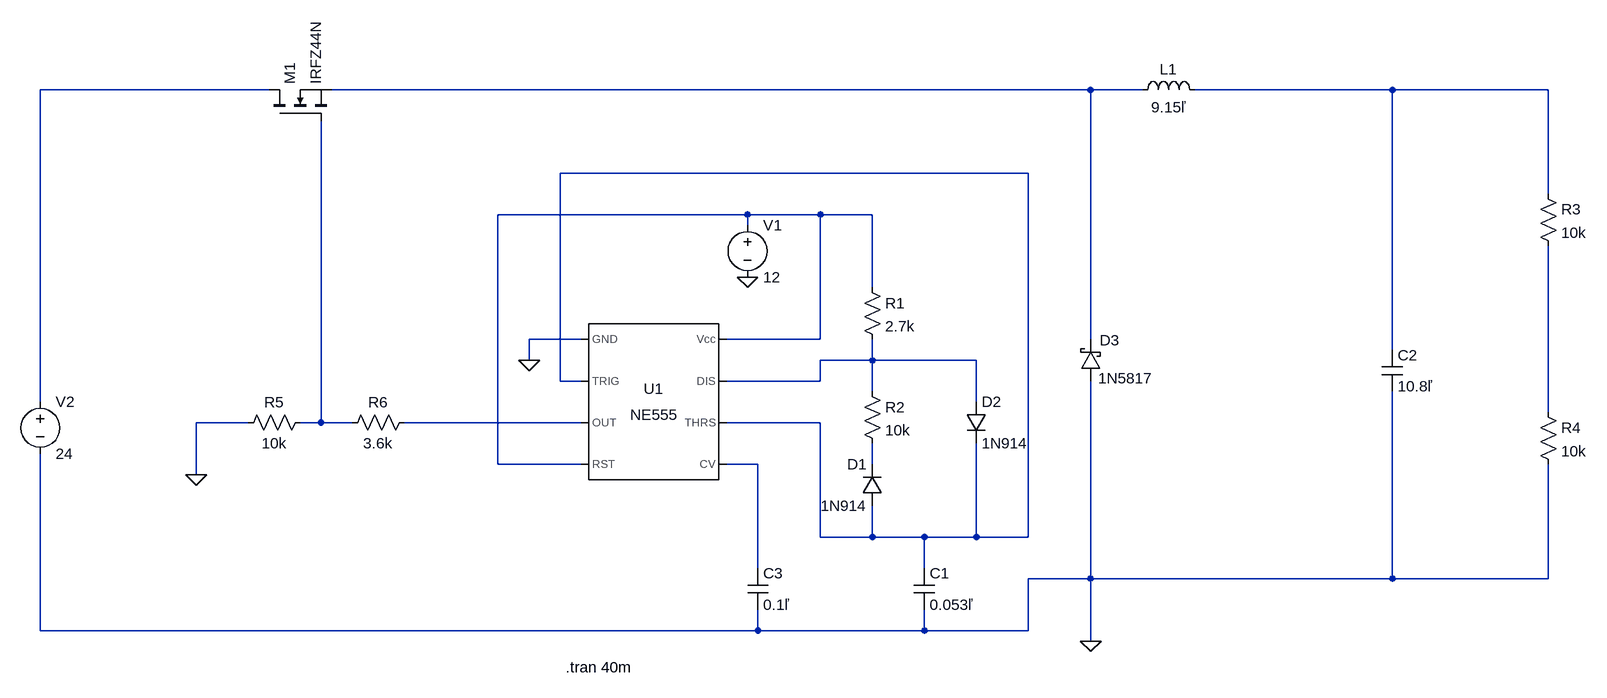
[diagram p0: schematic encore_new_.asc]
encore_new_.asc, the LTspice schematic file:
Version 4
SHEET 1 1524 680
WIRE -976 -336 -1328 -336
WIRE 288 -336 -880 -336
WIRE 368 -336 288 -336
WIRE 752 -336 448 -336
WIRE 992 -336 752 -336
WIRE 192 -208 -528 -208
WIRE 992 -176 992 -336
WIRE -240 -144 -624 -144
WIRE -128 -144 -240 -144
WIRE -48 -144 -128 -144
WIRE -240 -128 -240 -144
WIRE -48 -32 -48 -144
WIRE -496 48 -576 48
WIRE -128 48 -128 -144
WIRE -128 48 -272 48
WIRE 288 48 288 -336
WIRE 752 64 752 -336
WIRE -576 80 -576 48
WIRE -48 80 -48 48
WIRE -48 80 -128 80
WIRE 112 80 -48 80
WIRE -528 112 -528 -208
WIRE -496 112 -528 112
WIRE -128 112 -128 80
WIRE -128 112 -272 112
WIRE -48 128 -48 80
WIRE -1328 144 -1328 -336
WIRE 112 144 112 80
WIRE 992 160 992 -96
WIRE -1008 176 -1088 176
WIRE -896 176 -896 -288
WIRE -896 176 -928 176
WIRE -848 176 -896 176
WIRE -496 176 -768 176
WIRE -128 176 -272 176
WIRE -624 240 -624 -144
WIRE -496 240 -624 240
WIRE -224 240 -272 240
WIRE -48 240 -48 208
WIRE -1088 256 -1088 176
WIRE -128 352 -128 176
WIRE -48 352 -48 304
WIRE -48 352 -128 352
WIRE 32 352 -48 352
WIRE 112 352 112 208
WIRE 112 352 32 352
WIRE 192 352 192 -208
WIRE 192 352 112 352
WIRE -224 400 -224 240
WIRE 32 400 32 352
WIRE 288 416 288 112
WIRE 288 416 192 416
WIRE 752 416 752 128
WIRE 752 416 288 416
WIRE 992 416 992 240
WIRE 992 416 752 416
WIRE -1328 496 -1328 224
WIRE -224 496 -224 464
WIRE -224 496 -1328 496
WIRE 32 496 32 464
WIRE 32 496 -224 496
WIRE 192 496 192 416
WIRE 192 496 32 496
WIRE 288 512 288 416
FLAG -576 80 0
FLAG -240 -48 0
FLAG 288 512 0
FLAG -1088 256 0
SYMBOL Misc\\NE555 -384 144 R0
SYMATTR InstName U1
SYMBOL voltage -240 -144 R0
WINDOW 123 0 0 Left 0
WINDOW 39 0 0 Left 0
SYMATTR InstName V1
SYMATTR Value 12
SYMBOL res -64 -48 R0
SYMATTR InstName R1
SYMATTR Value 2.7k
SYMBOL res -64 112 R0
SYMATTR InstName R2
SYMATTR Value 10k
SYMBOL diode -32 304 R180
WINDOW 0 24 64 Left 2
WINDOW 3 24 0 Left 2
SYMATTR InstName D1
SYMATTR Value 1N914
SYMBOL diode 96 144 R0
SYMATTR InstName D2
SYMATTR Value 1N914
SYMBOL cap 16 400 R0
SYMATTR InstName C1
SYMATTR Value 0.053ľ
SYMBOL nmos -976 -288 R270
SYMATTR InstName M1
SYMATTR Value IRFZ44N
SYMBOL ind 352 -320 R270
WINDOW 0 32 56 VTop 2
WINDOW 3 5 56 VBottom 2
SYMATTR InstName L1
SYMATTR Value 9.15ľ
SYMBOL schottky 304 112 R180
WINDOW 0 -29 63 Left 2
WINDOW 3 -80 4 Left 2
SYMATTR InstName D3
SYMATTR Value 1N5817
SYMATTR Description Diode
SYMATTR Type diode
SYMBOL cap 736 64 R0
SYMATTR InstName C2
SYMATTR Value 10.8ľ
SYMBOL voltage -1328 128 R0
WINDOW 123 0 0 Left 0
WINDOW 39 0 0 Left 0
SYMATTR InstName V2
SYMATTR Value 24
SYMBOL cap -240 400 R0
SYMATTR InstName C3
SYMATTR Value 0.1ľ
SYMBOL res -912 160 R90
WINDOW 0 0 56 VBottom 2
WINDOW 3 32 56 VTop 2
SYMATTR InstName R5
SYMATTR Value 10k
SYMBOL res -752 160 R90
WINDOW 0 0 56 VBottom 2
WINDOW 3 32 56 VTop 2
SYMATTR InstName R6
SYMATTR Value 3.6k
SYMBOL res 976 -192 R0
SYMATTR InstName R3
SYMATTR Value 10k
SYMBOL res 976 144 R0
SYMATTR InstName R4
SYMATTR Value 10k
TEXT -520 552 Left 2 !.tran 40m

The netlist it stands for:
* encore_new_.asc
XU1 0 N004 N009 N005 N010 N004 N006 N005 NE555  ; pins GND TRIG OUT RST CV THRS DIS Vcc
V1 N005 0 12
R1 N005 N006 2.7k
R2 N006 N011 10k
D1 N004 N011 1N914
D2 N006 N004 1N914
C1 N004 0 0.053ľ
M1 N001 N008 N002 N002 IRFZ44N
L1 N002 N003 9.15ľ
D3 0 N002 1N5817
C2 N003 0 10.8ľ
V2 N001 0 24
C3 N010 0 0.1ľ
R5 N008 0 10k
R6 N009 N008 3.6k
R3 N003 N007 10k
R4 N007 0 10k
.model D D
.lib standard.dio
.model NMOS NMOS
.model PMOS PMOS
.lib standard.mos
.tran 40m
.lib NE555.sub
.backanno
.end